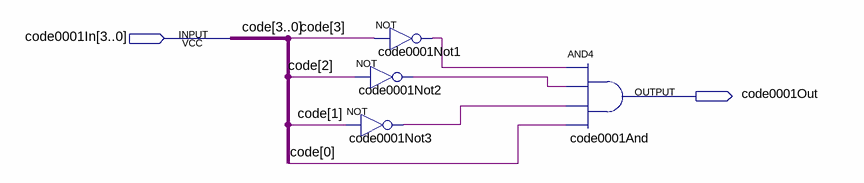
[diagram p0: schematic sheet]
// Quartus schematic code0001.bdf as structural Verilog: 4 symbols, 2 pins
module code0001 (
  input  [3:0] code0001In,
  output code0001Out
);

  wire code0001Not1_out, code0001Not2_out, code0001Not3_out;

  not code0001Not1 (code0001Not1_out, code0001In[3]);
  not code0001Not2 (code0001Not2_out, code0001In[2]);
  not code0001Not3 (code0001Not3_out, code0001In[1]);
  and code0001And (code0001Out, code0001Not1_out, code0001Not2_out, code0001Not3_out, code0001In[0]);

  // Other names for the same wires on the sheet: code[3:0] = code0001In
endmodule
